# Altium schematic sheet RGB_LEDs_INTERFACE.SchDoc
size A4; SheetNumber: 25; SheetTotal: 27
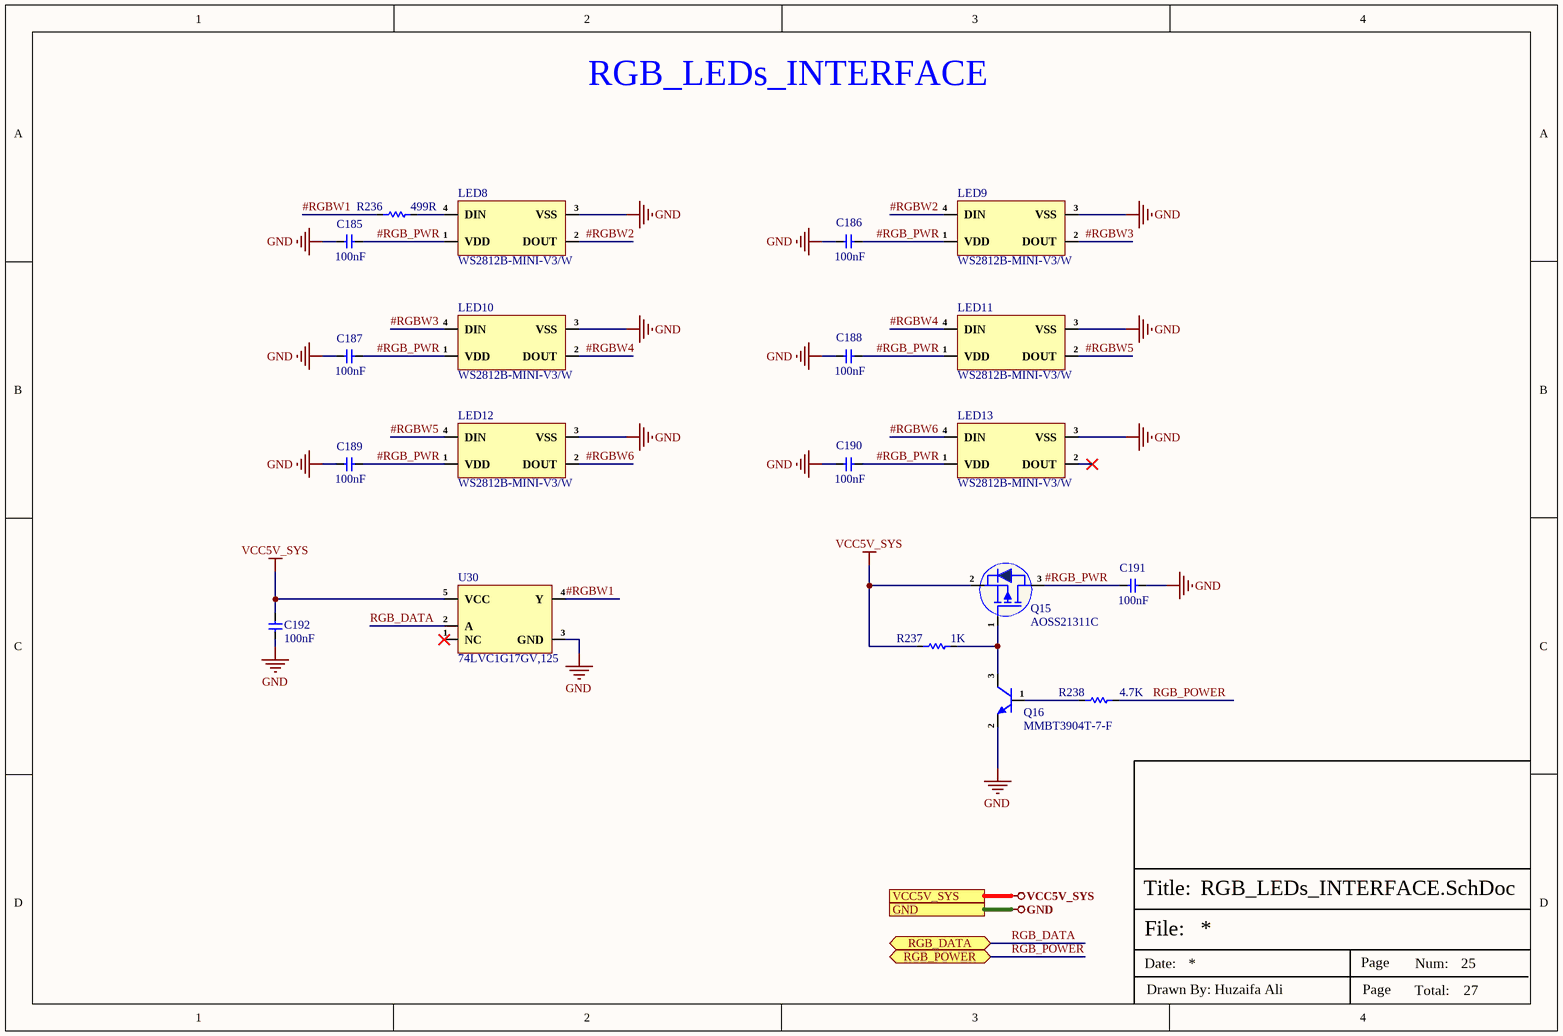
[diagram p0: RGB_LEDs_INTERFACE.SchDoc]

## Parts
C185  100nF  [Cap-0402]
C186  100nF  [Cap-0402]
C187  100nF  [Cap-0402]
C188  100nF  [Cap-0402]
C189  100nF  [Cap-0402]
C190  100nF  [Cap-0402]
C191  100nF  [Cap-0402]
C192  100nF  [Cap-0402]
LED8  WS2812B-MINI-V3/W  [SMD3535]
LED9  WS2812B-MINI-V3/W  [SMD3535]
LED10  WS2812B-MINI-V3/W  [SMD3535]
LED11  WS2812B-MINI-V3/W  [SMD3535]
LED12  WS2812B-MINI-V3/W  [SMD3535]
LED13  WS2812B-MINI-V3/W  [SMD3535]
Q15  AOSS21311C  [SOT-23]
Q16  MMBT3904T-7-F  [SOT-523]
R236  499R  [Res-0402]
R237  1K  [Res-0402]
R238  4.7K  [Res-0402]
U30  74LVC1G17GV,125  [SC-74A]

## Ports
GND (see TOP SHEET[4C], AUDIO_INTERFACE[1D], BUCK REGULATOR[3D], DEBUG_UART_INTERFACE[3D], DIGITAL IO_RELAY_SHEET[5D], DUAL_SIM_INTERFACE[3D], ETHERNET_PHY0[4D], ETHERNET_PHY1[4D], GSM_INTERFACE[2D], HDMI_INTERFACE[3D], INPUT_PROTECTION[3D], LINEAR_VOLTAGE_REG[3D], MICRO_SD_INTERFACE[3D], MIPI-DSI DISPLAY[3D], POWER SECTION[3D], PUSH BUTTONs_INTERFACE[3C], ROCKCHIP_PWR_SUPPLY[1D], ROCKCHIP_SYSTEM_CONTROL[3C], RS232_RS485_INTERFACE[3C], SENSOR_SHEET[3D], USB2.0_INTERFACE[3D], USB3.0_INTERFACE[3D], USB-C_INTERFACE[2D], WIEGAND_INTERFACE[3D], WIFI_BLUETOOTH_SHEET[4C]), RGB_DATA (bidir, see TOP SHEET[5C], ROCKCHIP_GPIO_NC PINS[2D]), RGB_POWER (bidir, see TOP SHEET[5C], ROCKCHIP_GPIO_NC PINS[2D]), VCC5V_SYS (see TOP SHEET[4C], BUCK REGULATOR[3D], DIGITAL IO_RELAY_SHEET[5D], HDMI_INTERFACE[3D], LINEAR_VOLTAGE_REG[3D], MIPI-DSI DISPLAY[3D], POWER SECTION[3D], ROCKCHIP_PWR_SUPPLY[1D], USB2.0_INTERFACE[3D], USB3.0_INTERFACE[3D], USB-C_INTERFACE[2D], WIEGAND_INTERFACE[3D])

## Nets
GND: C185.1 C186.1 C187.1 C188.1 C189.1 C190.1 C191.1 C192.1 LED8.3(VSS) LED9.3(VSS) LED10.3(VSS) LED11.3(VSS) LED12.3(VSS) LED13.3(VSS) Q16.2(E) U30.3(GND) ; port GND
VCC5V_SYS: C192.2 Q15.2(S) R237.1 U30.5(VCC) ; port VCC5V_SYS
#RGB_PWR: C185.2 C186.2 C187.2 C188.2 C189.2 C190.2 C191.2 LED8.1(VDD) LED9.1(VDD) LED10.1(VDD) LED11.1(VDD) LED12.1(VDD) LED13.1(VDD) Q15.3(D)
#RGBW1: R236.1 U30.4(Y)
#RGBW2: LED8.2(DOUT) LED9.4(DIN)
#RGBW3: LED9.2(DOUT) LED10.4(DIN)
#RGBW4: LED10.2(DOUT) LED11.4(DIN)
#RGBW5: LED11.2(DOUT) LED12.4(DIN)
#RGBW6: LED12.2(DOUT) LED13.4(DIN)
RGB_DATA: U30.2(A) ; port RGB_DATA
RGB_POWER: R238.2 ; port RGB_POWER
NetLED8_4: LED8.4(DIN) R236.2
NetQ15_1: Q15.1(G) Q16.3(C) R237.2
NetQ16_1: Q16.1(B) R238.1

Not connected (* = marked no-connect by the designer): LED13 2(DOUT)*; U30 1(NC)*

## Notes on the sheet
- RGB_LEDs_INTERFACE
- File:
- Title:
- Date:
- Page
- Num:
- Total:
- Drawn By: Huzaifa Ali

## Library data of the parts
C185-C192 = CC0402KRX5R7BB104: CAP CER 0.1UF 16V X5R 0402; Manufacturer: Yageo; Tolerance: 10%; Manufacturer Part Number: CC0402KRX5R7BB104; RoHS: Yes; Category: Ceramic Capacitors; Supplier 1: Mouser; Stock 1: 936792; Pricing 1: 1=0.10000, 10=0.02300, 50=0.02300, 100=0.01100, 1000=0.00600, 10000=0.00400 (USD); Mount: Surface Mount; Case/Package: 0402; Number of Pins: 2; Case Code (Metric): 1005; Case Code (Imperial): 0402; Min Operating Temperature: -55°C; Max Operating Temperature: 85°C; Capacitance: 100nF; Dielectric: X5R; Packaging: Tape and Reel; Voltage Rating: 16V; Package Quantity: 1; Voltage Rating (DC): 16V; Termination: SMD/SMT; Resistor Type: Ceramic; Series: CC; Construction: Flat; Length: 1mm; Width: 0.02inch; Height: 0.5mm; Thickness: 0.022inch; Depth: 0.5mm; Radiation Hardening: No; REACH SVHC: Unknown; Lead Free: Lead Free; Halogen Free: Halogen Free; RoHS Compliant: Yes; ComponentLink1URL: https://datasheet.ciiva.com/155/mlccorderingcode-155879.pdf?src-supplier=Digi-Key; ComponentLink1Description: https://datasheet.ciiva.com/155/mlccorderingcode-155879.pdf?src-supplier=Digi-Key; ComponentLink2URL: https://datasheet.ciiva.com/155/mlccorderingcode-155878.pdf?src-supplier=Digi-Key; ComponentLink2Description: https://datasheet.ciiva.com/155/mlccorderingcode-155878.pdf?src-supplier=Digi-Key; ComponentLink3URL: https://datasheet.ciiva.com/155/mlccorderingcode-155880.pdf?src-supplier=Digi-Key; ComponentLink3Description: https://datasheet.ciiva.com/155/mlccorderingcode-155880.pdf?src-supplier=Digi-Key; ComponentLink4URL: https://datasheet.ciiva.com/11464/upy-gphc-x5r-4v-to-50v-12-11464869.pdf?src-supplier=Avnet; ComponentLink4Description: https://datasheet.ciiva.com/11464/upy-gphc-x5r-4v-to-50v-12-11464869.pdf?src-supplier=Avnet; Supplier Part Number 1: 603-CC402KRX5R7BB104; LCSC Part Number: C106204
LED8-LED13 = WS2812B-MINI-V3/W: 12mA RGB SMD3535 Light Emitting Diodes (LED) ROHS; Manufacturer: Worldsemi; Item Type: RGB  LED; Manufacturer Part Number: WS2812B-MINI-V3/W; Package: SMD3535; LCSC Part Number: C527089; ComponentLink1Description: LCSC; ComponentLink1URL: https://www.lcsc.com/product-detail/Light-Emitting-Diodes-LED_Worldsemi-WS2812B-MINI-V3-W_C527089.html
Q15 = AOSS21311C: MOSFET P-CH 30V 4.3A SOT23-3; Manufacturer: Alpha & Omega Semiconductor; Supplier: Digikey; Supplier Part Number: 785-AOSS21311CCT-ND; Manufacturer Part Number: AOSS21311C; RoHS: Yes; Category: Transistors; Stock: 15013; Pricing: 1=0.44, 10=0.314, 100=0.1582, 500=0.14016, 1000=0.10908 (USD); LCSC Part Number: C3280149; Item Type: MOSFET
Q16 = MMBT3904T-7-F: TRANS NPN 40V 0.2A SOT523; Manufacturer: Diodes Zetex; Item Type: Transistor; Supplier: Future Electronics; Supplier Part Number: 4140292; Manufacturer Part Number: MMBT3904T-7-F; RoHS: Yes; Category: BJTs; Stock: 36000; Pricing: 3000=0.0261, 9000=0.0252, 15000=0.0248, 60000=0.0236, 90000=0.0229 (USD); ComponentLink1URL: https://datasheet.ciiva.com/15139/getdatasheetpartid-142850-15139485.pdf?src-supplier=Verical; ComponentLink1Description: https://datasheet.ciiva.com/15139/getdatasheetpartid-142850-15139485.pdf?src-supplier=Verical; ComponentLink2URL: https://datasheet.ciiva.com/11199/ds30270-11199009.pdf?src-supplier=Avnet; ComponentLink2Description: https://datasheet.ciiva.com/11199/ds30270-11199009.pdf?src-supplier=Avnet; ComponentLink3URL: https://datasheet.ciiva.com/17053/0900766b80e49818-17053736.pdf?src-supplier=Allied+Electronics; ComponentLink3Description: https://datasheet.ciiva.com/17053/0900766b80e49818-17053736.pdf?src-supplier=Allied+Electronics; ComponentLink4URL: https://datasheet.ciiva.com/8029/ds30270-8029717.pdf?src-supplier=Element14; ComponentLink4Description: https://datasheet.ciiva.com/8029/ds30270-8029717.pdf?src-supplier=Element14; ComponentLink5URL: https://datasheet.ciiva.com/22711/480146-22711751.pdf?src-supplier=Element14; ComponentLink5Description: https://datasheet.ciiva.com/22711/480146-22711751.pdf?src-supplier=Element14; ComponentLink6URL: https://datasheet.ciiva.com/4723/ds30270-4723401.pdf?src-supplier=Mouser; ComponentLink6Description: https://datasheet.ciiva.com/4723/ds30270-4723401.pdf?src-supplier=Mouser; ComponentLink7URL: https://datasheet.ciiva.com/6360/ds30270-6360919.pdf?src-supplier=Digikey; ComponentLink7Description: https://datasheet.ciiva.com/6360/ds30270-6360919.pdf?src-supplier=Digikey; LCSC Part Number: C239187
R236 = RC0402FR-07499RL: RES 499 OHM 1% 1/16W 0402; Manufacturer: Yageo; Power Rating: 62.5mW; Voltage Rating: 50V; Max Power Dissipation: 63mW; Temperature Coefficient: 100ppm/°C; Supplier 1: Mouser; Manufacturer Part Number: RC0402FR-07499RL; RoHS: Yes; Category: Chip SMD Resistors; Stock 1: 936879; Pricing 1: 1=0.10000, 10=0.01200, 50=0.01200, 100=0.00500, 1000=0.00300, 10000=0.00100 (USD); Case/Package: 0402; Case Code (Metric): 1005; Case Code (Imperial): 0402; Size Code: 0402; Min Operating Temperature: -55°C; Max Operating Temperature: 155°C; Resistance: 499R; Tolerance: 1%; Package Quantity: 1; Packaging: Tape and Reel; Resistor Type: Thick Film; Number of Terminations: 2; Termination: SMD/SMT; Voltage Rating (DC): 50V; Features: Moisture Resistant; Series: RC; Resistance Tolerance: 1%; Construction: Rectangular; Length: 1mm; Width: 0.02inch; Height: 0.016inch; Depth: 0.5mm; RoHS Compliant: Yes; REACH SVHC: No SVHC; Military Standard: Not; Lead Free: Lead Free; ComponentLink1URL: https://datasheet.ciiva.com/2453/pyu-r-int-thick-7-2453539.pdf?src-supplier=Digi-Key; ComponentLink1Description: https://datasheet.ciiva.com/2453/pyu-r-int-thick-7-2453539.pdf?src-supplier=Digi-Key; ComponentLink2URL: https://datasheet.ciiva.com/2453/pyu-r-int-thick-7-2453540.pdf?src-supplier=Digi-Key; ComponentLink2Description: https://datasheet.ciiva.com/2453/pyu-r-int-thick-7-2453540.pdf?src-supplier=Digi-Key; ComponentLink3URL: https://datasheet.ciiva.com/2453/pyu-r-int-thick-7-2453538.pdf?src-supplier=Digi-Key; ComponentLink3Description: https://datasheet.ciiva.com/2453/pyu-r-int-thick-7-2453538.pdf?src-supplier=Digi-Key; Supplier Part Number 1: 603-RC0402FR-07499RL; LCSC Part Number: C137970
R237 = RC0402FR-071KL: RES 1K OHM 1% 1/16W 0402; Manufacturer: Yageo; Resistance: 1kR; Temperature Coefficient: 100ppm/°C; Voltage Rating (DC): 50V; Power Rating: 62.5mW; Max Power Dissipation: 63mW; Item Type: Resistor; Supplier 1: Avnet; Manufacturer Part Number: RC0402FR-071KL; RoHS: Yes; Category: Chip SMD Resistors; Stock 1: 13030000; Pricing 1: 10000=0.00085, 20000=0.00087, 40000=0.00084, 60000=0.00083, 80000=0.00079, 100000=0.00078, 1000000=0.00076 (USD); Case/Package: 0402; Number of Pins: 2; Case Code (Imperial): 0402; Case Code (Metric): 1005; Size Code: 0402; Min Operating Temperature: -55°C; Max Operating Temperature: 155°C; Resistor Type: Thick Film; Tolerance: 1%; Packaging: Tape and Reel; Voltage Rating: 50V; Termination: SMD/SMT; Features: Moisture Resistant; Series: RC; Number of Terminations: 2; Resistance Tolerance: 1%; Construction: Rectangular; Technology: THICK FILM; Length: 1mm; Width: 0.5mm; Height: 0.32mm; Depth: 0.5mm; Reach SVHC Compliant: Yes; Lead Free: Lead Free; RoHS Compliant: Yes; Military Standard: Not; ComponentLink1URL: https://datasheet.ciiva.com/11819/0900766b80c66297-11819477.pdf?src-supplier=RSComponents; ComponentLink1Description: https://datasheet.ciiva.com/11819/0900766b80c66297-11819477.pdf?src-supplier=RSComponents; ComponentLink2URL: https://datasheet.ciiva.com/7983/1018594-7983502.pdf?src-supplier=Element14; ComponentLink2Description: https://datasheet.ciiva.com/7983/1018594-7983502.pdf?src-supplier=Element14; ComponentLink3URL: https://datasheet.ciiva.com/22747/1018594-22747513.pdf?src-supplier=Element14; ComponentLink3Description: https://datasheet.ciiva.com/22747/1018594-22747513.pdf?src-supplier=Element14; ComponentLink4URL: https://datasheet.ciiva.com/12666/pyu-rc0402-51-rohs-l-6-r-12666741.pdf?src-supplier=Mouser; ComponentLink4Description: https://datasheet.ciiva.com/12666/pyu-rc0402-51-rohs-l-6-r-12666741.pdf?src-supplier=Mouser; ComponentLink5URL: https://datasheet.ciiva.com/7849/1018594-7849869.pdf?src-supplier=Element14; ComponentLink5Description: https://datasheet.ciiva.com/7849/1018594-7849869.pdf?src-supplier=Element14; ComponentLink6URL: https://datasheet.ciiva.com/7849/1018594-7849871.pdf?src-supplier=Element14; ComponentLink6Description: https://datasheet.ciiva.com/7849/1018594-7849871.pdf?src-supplier=Element14; ComponentLink7URL: https://datasheet.ciiva.com/17063/pyu-rc0402-51-rohs-l-6-r-17063193.pdf?src-supplier=Future+Electronics; ComponentLink7Description: https://datasheet.ciiva.com/17063/pyu-rc0402-51-rohs-l-6-r-17063193.pdf?src-supplier=Future+Electronics; Supplier Part Number 1: RC0402FR-071KL; LCSC Part Number: C106235
R238 = RC0402FR-074K7L: RES 4.7K OHM 1% 1/16W 0402; Manufacturer: Yageo; Voltage Rating (DC): 50V; Power Rating: 62.5mW; Resistance: 4.7kR; Temperature Coefficient: 100ppm/°C; Max Power Dissipation: 63mW; Item Type: Resistor; Supplier 1: Avnet; Manufacturer Part Number: RC0402FR-074K7L; RoHS: Yes; Category: Chip SMD Resistors; Stock 1: 2420000; Pricing 1: 10000=0.00085 (USD); Case/Package: 0402; Number of Pins: 2; Case Code (Imperial): 0402; Case Code (Metric): 1005; Size Code: 0402; Min Operating Temperature: -55°C; Max Operating Temperature: 155°C; Tolerance: 1%; Voltage Rating: 50V; Packaging: Tape and Reel; Resistor Type: Thick Film; Termination: SMD/SMT; Features: Moisture Resistant; Series: RC; Number of Terminations: 2; Resistance Tolerance: 1%; Construction: Rectangular; Length: 1mm; Width: 0.5mm; Height: 0.32mm; Depth: 0.5mm; Height - Seated (Max): 0.016inch; RoHS Compliant: Yes; Reach SVHC Compliant: Yes; Military Standard: Not; Lead Free: Lead Free; ComponentLink1URL: https://datasheet.ciiva.com/22661/1686128-22661342.pdf?src-supplier=Element14; ComponentLink1Description: https://datasheet.ciiva.com/22661/1686128-22661342.pdf?src-supplier=Element14; ComponentLink2URL: https://datasheet.ciiva.com/7850/1018594-7850022.pdf?src-supplier=Element14; ComponentLink2Description: https://datasheet.ciiva.com/7850/1018594-7850022.pdf?src-supplier=Element14; ComponentLink3URL: https://datasheet.ciiva.com/7850/1018594-7850023.pdf?src-supplier=Element14; ComponentLink3Description: https://datasheet.ciiva.com/7850/1018594-7850023.pdf?src-supplier=Element14; ComponentLink4URL: https://datasheet.ciiva.com/15215/getdatasheetpartid-328119-15215035.pdf?src-supplier=Verical; ComponentLink4Description: https://datasheet.ciiva.com/15215/getdatasheetpartid-328119-15215035.pdf?src-supplier=Verical; Supplier Part Number 1: RC0402FR-074K7L; LCSC Part Number: C105871
U30 = 74LVC1G17GV,125: IC BUFFER SCHMITT TRIGGER 5TSOP; Manufacturer: Nexperia; Number of Channels: 1NUMBER; Supplier: Future Electronics; Supplier Part Number: 9876707; Manufacturer Part Number: 74LVC1G17GV,125; RoHS: Yes; Category: Logic Gates; Stock: 513000; Pricing: 3000=0.0334, 9000=0.0322, 30000=0.031, 60000=0.0303, 120000=0.029 (USD); Pins: 5NUMBER; Packaging: 10Packaging; RoHS Compliant: Yes; ComponentLink1URL: http://www.farnell.com/datasheets/2185283.pdf?src-supplier=Farnell; ComponentLink1Description: http://www.farnell.com/datasheets/2185283.pdf?src-supplier=Farnell; ComponentLink2URL: https://datasheet.octopart.com/74LVC1G17GV%2C125-Nexperia-datasheet-11799833.pdf?src-supplier=Farnell; ComponentLink2Description: https://datasheet.octopart.com/74LVC1G17GV%2C125-Nexperia-datasheet-11799833.pdf?src-supplier=Farnell; ComponentLink3URL: https://assets.nexperia.com/documents/data-sheet/74LVC1G17.pdf?src-supplier=Digikey; ComponentLink3Description: https://assets.nexperia.com/documents/data-sheet/74LVC1G17.pdf?src-supplier=Digikey; ComponentLink4URL: https://datasheet.octopart.com/74LVC1G17GV%2C125-Nexperia-datasheet-116120530.pdf?src-supplier=Future+Electronics; ComponentLink4Description: https://datasheet.octopart.com/74LVC1G17GV%2C125-Nexperia-datasheet-116120530.pdf?src-supplier=Future+Electronics; ComponentLink5URL: https://datasheet.octopart.com/74LVC1G17GV%2C125-Nexperia-datasheet-73818103.pdf?src-supplier=Element14; ComponentLink5Description: https://datasheet.octopart.com/74LVC1G17GV%2C125-Nexperia-datasheet-73818103.pdf?src-supplier=Element14; ComponentLink6URL: https://datasheet.octopart.com/74LVC1G17GV%2C125-NXP-Semiconductors-datasheet-13026859.pdf?src-supplier=Newark; ComponentLink6Description: https://datasheet.octopart.com/74LVC1G17GV%2C125-NXP-Semiconductors-datasheet-13026859.pdf?src-supplier=Newark; LCSC Part Number: C6076; Item Type: IC